# Altium schematic sheet Microphone-Other Parts.SchDoc: Ornihopter Kamera Kartı
size A3; CompanyName: Erü EEM; Engineer: Berat Bayram; Address1: https://www.linkedin.com/in/beratbayram-eee/; DocumentNumber: OKK_1; Revision: V1; SheetNumber: 3; SheetTotal: 5
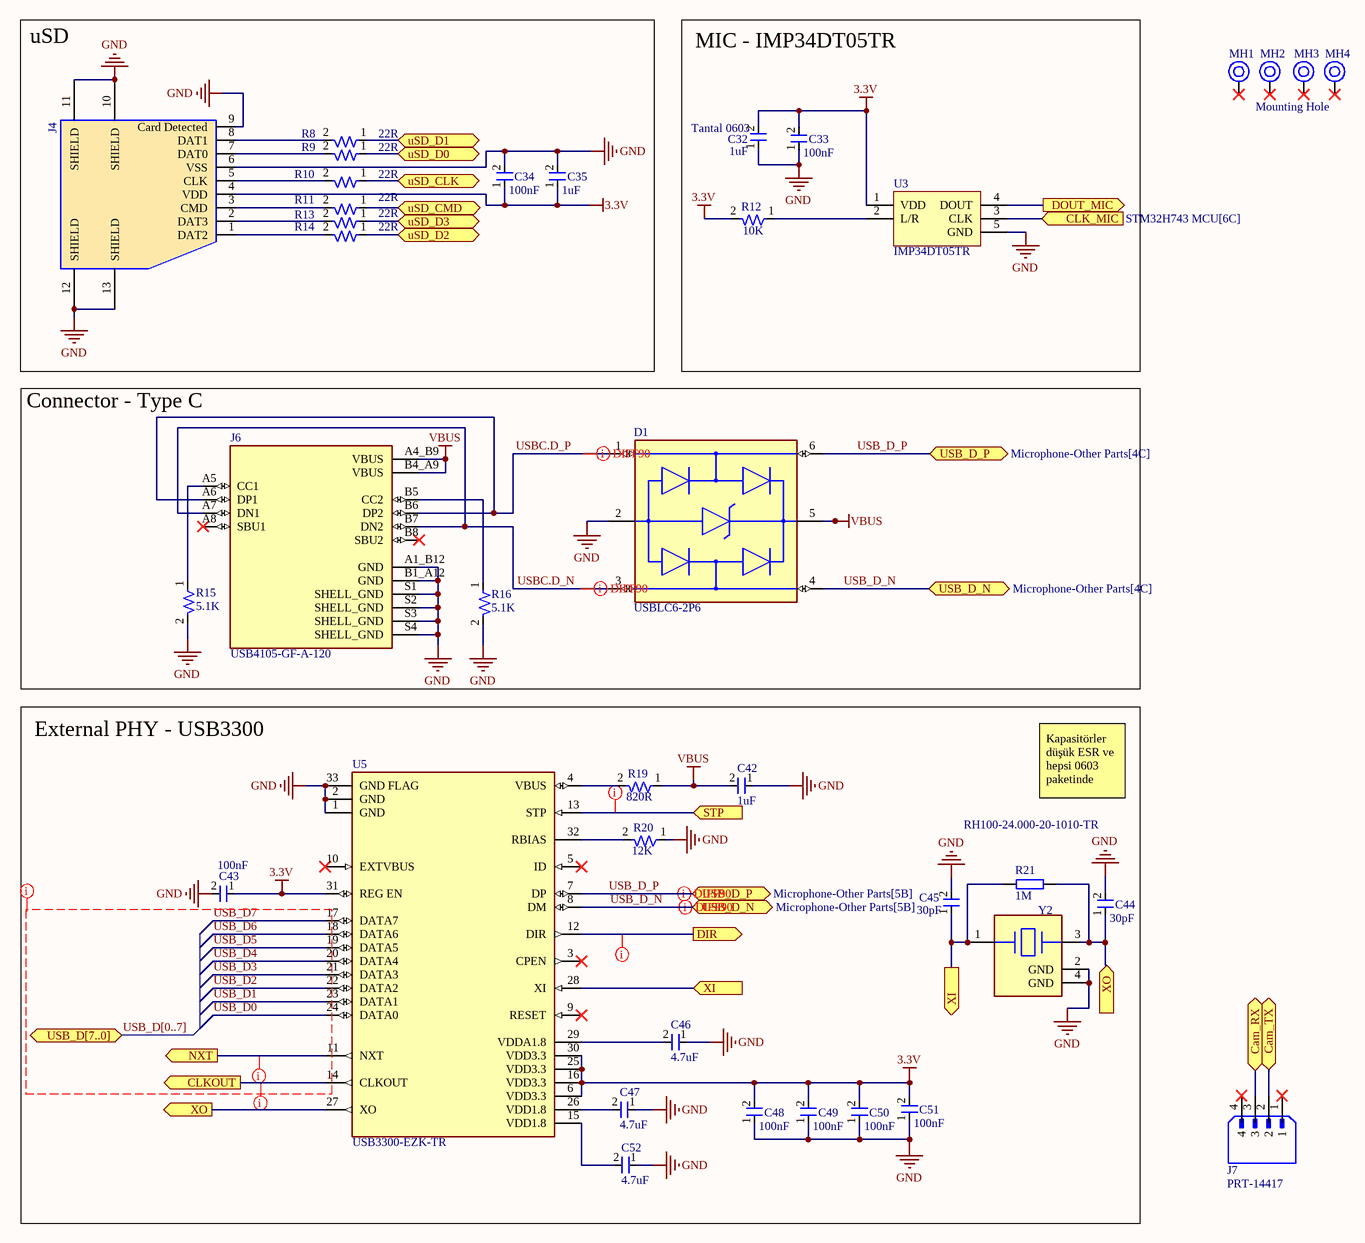
[diagram p0: Microphone-Other Parts.SchDoc]

## Parts
C32  Tantal 0603  C: 1uF  [0603 Cap]
C33  C: 100nF  [0603 Cap]  (hidden comment: 0603)
C34  C: 100nF  [0603 Cap]  (hidden comment: 0603)
C35  C: 1uF  [0603 Cap]  (hidden comment: 0603)
C42  C: 1uF  [0603 Cap]  (hidden comment: 0603)
C43  C: 100nF  [0603 Cap]  (hidden comment: 0603)
C44  C: 30pF  [0603 Cap]  (hidden comment: 0603)
C45  C: 30pF  [0603 Cap]  (hidden comment: 0603)
C46  C: 4.7uF  [0603 Cap]  (hidden comment: 0603)
C47  C: 4.7uF  [0603 Cap]  (hidden comment: 0603)
C48  C: 100nF  [0603 Cap]  (hidden comment: 0603)
C49  C: 100nF  [0603 Cap]  (hidden comment: 0603)
C50  C: 100nF  [0603 Cap]  (hidden comment: 0603)
C51  C: 100nF  [0603 Cap]  (hidden comment: 0603)
C52  C: 4.7uF  [0603 Cap]  (hidden comment: 0603)
D1  USBLC6-2P6  [FP-SOT-666-MFG]
J4  KLS1-TF-003-R  [KLS1-TF-003-R]  (value not drawn)
J6  USB4105-GF-A-120  [GCT_USB4105-GF-A-120]
J7  PRT-14417  [SPARKFUN_PRT-14417]
MH1  Mounting Hole  [MOUNTING]
MH2  Mounting Hole  [MOUNTING]  (value not drawn)
MH3  Mounting Hole  [MOUNTING]  (value not drawn)
MH4  Mounting Hole  [MOUNTING]  (value not drawn)
R8  R: 22R  [0603 Res]  (hidden comment: 0603)
R9  R: 22R  [0603 Res]  (hidden comment: 0603)
R10  R: 22R  [0603 Res]  (hidden comment: 0603)
R11  R: 22R  [0603 Res]  (hidden comment: 0603)
R12  R: 10K  [0603 Res]  (hidden comment: 0603)
R13  R: 22R  [0603 Res]  (hidden comment: 0603)
R14  R: 22R  [0603 Res]  (hidden comment: 0603)
R15  R: 5.1K  [0603 Res]  (hidden comment: 0603)
R16  R: 5.1K  [0603 Res]  (hidden comment: 0603)
R19  R: 820R  [0603 Res]  (hidden comment: 0603)
R20  R: 12K  [0603 Res]  (hidden comment: 0603)
R21  1M  [RES_0603]
U3  IMP34DT05TR  [HCLGA-4_53_137_15X37_SMD]
U5  USB3300-EZK-TR  [FP-32QFN-3304-5X5B-MFG]
Y2  RH100-24.000-20-1010-TR  [FP-ABM8AIG-MFG]

## Blocks framed on the sheet
uSD: C34 C35 J4 R8-R11 R13 R14
MIC - IMP34DT05TR: C32 C33 R12 U3
Connector - Type C: D1 J6 R15 R16
External PHY - USB3300: C42-C52 R19-R21 U5 Y2

## Ports
Cam_RX (bidir, see STM32H743 MCU[2C]), Cam_TX (bidir, see STM32H743 MCU[2C]), CLK_MIC (in, see STM32H743 MCU[6C]), CLKOUT (out, see STM32H743 MCU[2C]), DIR (out, see STM32H743 MCU[4C]), DOUT_MIC (out, see STM32H743 MCU[6C]), NXT (out, see STM32H743 MCU[4C]), STP (in, see STM32H743 MCU[4C]), USB_D[7..0] (bidir, see STM32H743 MCU[7C]), USB_D_N (bidir, see Microphone-Other Parts[4C]), USB_D_N (bidir, see Microphone-Other Parts[5B]), USB_D_P (bidir, see Microphone-Other Parts[4C]), USB_D_P (bidir, see Microphone-Other Parts[5B]), uSD_CLK (bidir, see STM32H743 MCU[4C]), uSD_CMD (bidir, see STM32H743 MCU[4B]), uSD_D0 (bidir, see STM32H743 MCU[4C]), uSD_D1 (bidir, see STM32H743 MCU[4C]), uSD_D2 (bidir, see STM32H743 MCU[4C]), uSD_D3 (bidir, see STM32H743 MCU[4C]), XI (in, see Microphone-Other Parts[5C]), XI (out, see Microphone-Other Parts[4C]), XO (in, see Microphone-Other Parts[2D]), XO (out, see Microphone-Other Parts[6C])

## Nets
3.3V: C32.2 C33.2 C34.1 C35.1 C43.1 C48.2 C49.2 C50.2 C51.2 J4.4(VDD) R12.2 U3.1(VDD) U5.6(VDD3.3) U5.16(VDD3.3) U5.25(VDD3.3) U5.30(VDD3.3) U5.31(REG_EN)
GND: C32.1 C33.1 C34.2 C35.2 C42.1 C43.2 C44.2 C45.2 C46.1 C47.1 C48.1 C49.1 C50.1 C51.1 C52.1 D1.2(GND) J4.6(VSS) J4.9(Card_Detected) J4.10(SHIELD) J4.11(SHIELD) J4.12(SHIELD) J4.13(SHIELD) J6.A1_B12(GND) J6.B1_A12(GND) J6.S1(SHELL_GND) J6.S2(SHELL_GND) J6.S3(SHELL_GND) J6.S4(SHELL_GND) R15.2 R16.2 R20.1 U3.5(GND) U5.1(GND) U5.2(GND) U5.33(GND_FLAG) Y2.2(GND) Y2.4(GND)
VBUS: C42.2 D1.5(VBUS) J6.A4_B9(VBUS) J6.B4_A9(VBUS) R19.1
Cam_RX: J7.3 ; port Cam_RX
Cam_TX: J7.2 ; port Cam_TX
CLK_MIC: U3.3(CLK) ; port CLK_MIC
CLKOUT: U5.14(CLKOUT) ; port CLKOUT
DIR: U5.12(DIR) ; port DIR
DOUT_MIC: U3.4(DOUT) ; port DOUT_MIC
NXT: U5.11(NXT) ; port NXT
STP: U5.13(STP) ; port STP
USB_D0: U5.24(DATA0)
USB_D1: U5.23(DATA1)
USB_D2: U5.22(DATA2)
USB_D3: U5.21(DATA3)
USB_D4: U5.20(DATA4)
USB_D5: U5.19(DATA5)
USB_D6: U5.18(DATA6)
USB_D7: U5.17(DATA7)
USB_D_N: D1.4(I/O2) U5.8(DM) ; port USB_D_N
USB_D_P: D1.6(I/O1) U5.7(DP) ; port USB_D_P
USBC.D_N: D1.3(I/O2) J6.A7(DN1) J6.B7(DN2)
USBC.D_P: D1.1(I/O1) J6.A6(DP1) J6.B6(DP2)
uSD_CLK: R10.1 ; port uSD_CLK
uSD_CMD: R11.1 ; port uSD_CMD
uSD_D0: R9.1 ; port uSD_D0
uSD_D1: R8.1 ; port uSD_D1
uSD_D2: R14.1 ; port uSD_D2
uSD_D3: R13.1 ; port uSD_D3
XI: C45.1 R21.1 U5.28(XI) Y2.1 ; port XI
XO: C44.1 R21.2 U5.27(XO) Y2.3 ; port XO
NetC46_2: C46.2 U5.29(VDDA1.8)
NetC47_2: C47.2 U5.26(VDD1.8)
NetC52_2: C52.2 U5.15(VDD1.8)
NetJ4_1: J4.1(DAT2) R14.2
NetJ4_2: J4.2(DAT3) R13.2
NetJ4_3: J4.3(CMD) R11.2
NetJ4_5: J4.5(CLK) R10.2
NetJ4_7: J4.7(DAT0) R9.2
NetJ4_8: J4.8(DAT1) R8.2
NetJ6_A5: J6.A5(CC1) R15.1
NetJ6_B5: J6.B5(CC2) R16.1
NetR12_1: R12.1 U3.2(L/R)
NetR19_2: R19.2 U5.4(VBUS)
NetR20_2: R20.2 U5.32(RBIAS)

Not connected (* = marked no-connect by the designer): J6 A8(SBU1)* B8(SBU2)*; J7 1* 4*; MH1 1*; MH2 1*; MH3 1*; MH4 1*; U5 3(CPEN)* 5(ID)* 9(RESET)* 10(EXTVBUS)*

## Buses and harness runs
bus USB_D[0..7] = port USB_D[7..0]

## Layout directives
differential pair; differential pair class DIFF90: USB_D_N, USB_D_P, USBC.D_N, USBC.D_P
net class USB3300: CLKOUT, DIR, NXT, STP, USB_D0, USB_D1, USB_D2, USB_D3, USB_D4, USB_D5, USB_D6, USB_D7, USB_D[0..7]

## Notes on the sheet
- Kapasitörler düşük ESR ve hepsi 0603 paketinde
- Title:
- Enigneer:
- Page Contents:
- Company:
- Size:
- Date:
- File:
- Website:
- A3
- Number:
- Time:
- Revision:
- Sheet

## Library data of the parts
C32-C35 C42-C52 = 0603 Cap
D1 = CMP-12225-000058-1: TVS DIODE 5.25V 17V SOT666; Min Breakdown Voltage: 6V; Power Line Protection: Yes; Element Configuration: Dual; Test Current: 1mA; Working Voltage: 5V; Number of Channels: 2; Max Reverse Leakage Current: 150nA; Direction: Unidirectional; Peak Pulse Current: 5A; Number of Elements: 1; Capacitance: 3.5pF; Max Breakdown Voltage: 6V; Height: 0.6mm; Depth: 1.3mm; Contact Plating: Tin; Reverse Breakdown Voltage: 6V; REACH SVHC: No SVHC; Operating Supply Voltage: 5V; Width: 1.3mm; Max Operating Temperature: 125°C; Reverse Standoff Voltage: 5V; ESD Protection: Yes; Package Quantity: 1; Termination: SMD/SMT; Length: 1.7mm; Leakage Current: 150nA; Number of Bidirectional Channels: 2; Case/Package: SOT-666; Min Operating Temperature: -40°C; Number of Pins: 6; Clamping Voltage: 17V; Breakdown Voltage: 6V; Lead Free: Lead Free; Radiation Hardening: No; Packaging: Tape and Reel; Mount: Surface Mount; Polarity: Unidirectional
J4 = KLS1-TF-003-R: KLS1-TF-003-R                     SD CARD CONNECTOR
J6 = USB4105-GF-A-120: USB CONN, 2.0 TYPE C, RCPT, 16POS, SMT; USB Connector Type:USB Type C; USB Standard:USB 2.0; Gender:Receptacle; No. of Positions:16Positions; Connector Mounting:Surface Mount, Through Hole Mount; Orientation:Right Angle RoHS Compliant: Yes; MF: Global Connector Technology; MP: USB4105GFA120; Package: None; Price: None; Value: *; SnapEDA_Link: https://www.snapeda.com/parts/USB4105GFA120/Global+Connector+Technology/view-part/?ref=snap; Availability: In Stock; Check_prices: https://www.snapeda.com/parts/USB4105GFA120/Global+Connector+Technology/view-part/?ref=eda
J7 = PRT-14417: QWIIC JST CONNECTOR - SMD 4-PIN; MF: SparkFun Electronics; SnapEDA_Link: https://www.snapeda.com/parts/PRT-14417/SparkFun+Electronics/view-part/?ref=snap; Package: None; Value: *; MP: PRT-14417; Check_prices: https://www.snapeda.com/parts/PRT-14417/SparkFun+Electronics/view-part/?ref=eda
MH1-MH4 = MH_3.5H_6D: Manufacturer Part Number: NA; Case/Package: TH; Manufacturer: NA; Supplier-1: NA; Supplier Part Number-1: NA; Alternate Part Number-1: NA
R8-R16 R19 R20 = 0603 Res
R21 = RES_0603: Resistor SMD 0603; Manufacturer: *; Manufacturer Part Number: *; Distributor Link: *; LCSC: *
U3 = IC_IMP34DT05TR: MEMS Microphones AUTO & INDUSTRIAL SENSORS; Manufacturer: STMicroelectronics; Alternate Part Number-1: NA; Manufacturer Part Number: IMP34DT05TR; Case/Package: HCLGA-4; Supplier-1: Mouser; Supplier Part Number-1: 511-IMP34DT05TR
U5 = CMP-0186-00339-2: IC CONTROLLER USB 32QFN; Manufacturer: Microchip; Min Supply Voltage: 3V; Standoff Height: 0mm; Interface: USB,Other; Number Of Ports: 1; Usb Standard: USB 2.0; Nominal Supply Current: 25.5-39600uA; Max Supply Voltage: 3.6V; Temperature Range High: +85°C; Mouser Description: USB Interface IC USB 2.0 PHY ULPI; Device Class L3: USB Interface ICs; Package: 32QFN-3304-5X5B; ComponentLink2URL: http://ww1.microchip.com/downloads/en/DeviceDoc/00001783C.pdf; Ambient Temperature Range Low: -40°C; Temperature Range Low: -40°C; Temperature: -40°C to +85°C; ComponentLink2Description: Datasheet; RoHS: TRUE; Digikey Description: IC CONTROLLER USB 32QFN; Device Class L1: Integrated Circuits (ICs); Manufacturer Part Number: USB3300-EZK-TR; Automotive: No; Height: 1mm; Ipc Land Pattern Name: QFN50P500X500X85-32; Lead Free: Yes; Ambient Temperature Range High: +85°C; Category: IC; Device Class L2: Interface ICs; Octopart: https://octopart.com/usb3300-ezk-tr-microchip-24995444
Y2 = CMP-27762-015716-1: Crystal 24MHz ±20ppm (Tol) ±50ppm (Stability) 12pF FUND 50Ω Automotive 4-Pin Ultra Mini-CSMD T/R; ESR (Equivalent Series Resistance): 50R; Series: ABM8AIG; RoHS Compliant: Yes; Load Capacitance: 12pF; Height: 0.031inch; Min Operating Temperature: -40°C; Mount: Surface Mount; Packaging: Cut Tape; Ratings: AEC-Q200; Case/Package: SMD/SMT; Frequency Stability: 50ppm; Max Operating Temperature: 125°C; Length: 0.126inch; Frequency: 24MHz; Frequency Tolerance: 20ppm; Width: 0.098inch